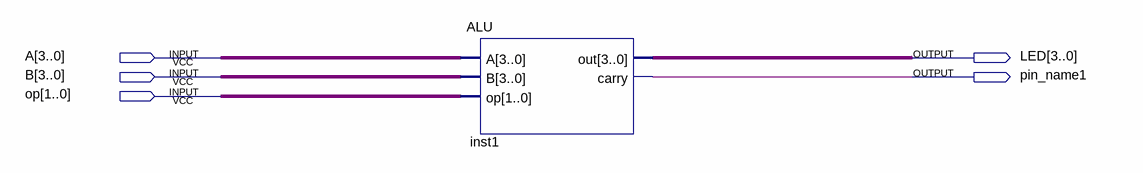
[diagram p0: schematic sheet]
// Quartus schematic top.bdf as structural Verilog: 1 symbols, 5 pins
module top (
  input  [3:0] A,
  input  [3:0] B,
  input  [1:0] op,
  output [3:0] LED,
  output pin_name1
);

  ALU inst1 (.A(A), .B(B), .op(op), .out(LED), .carry(pin_name1));
endmodule
